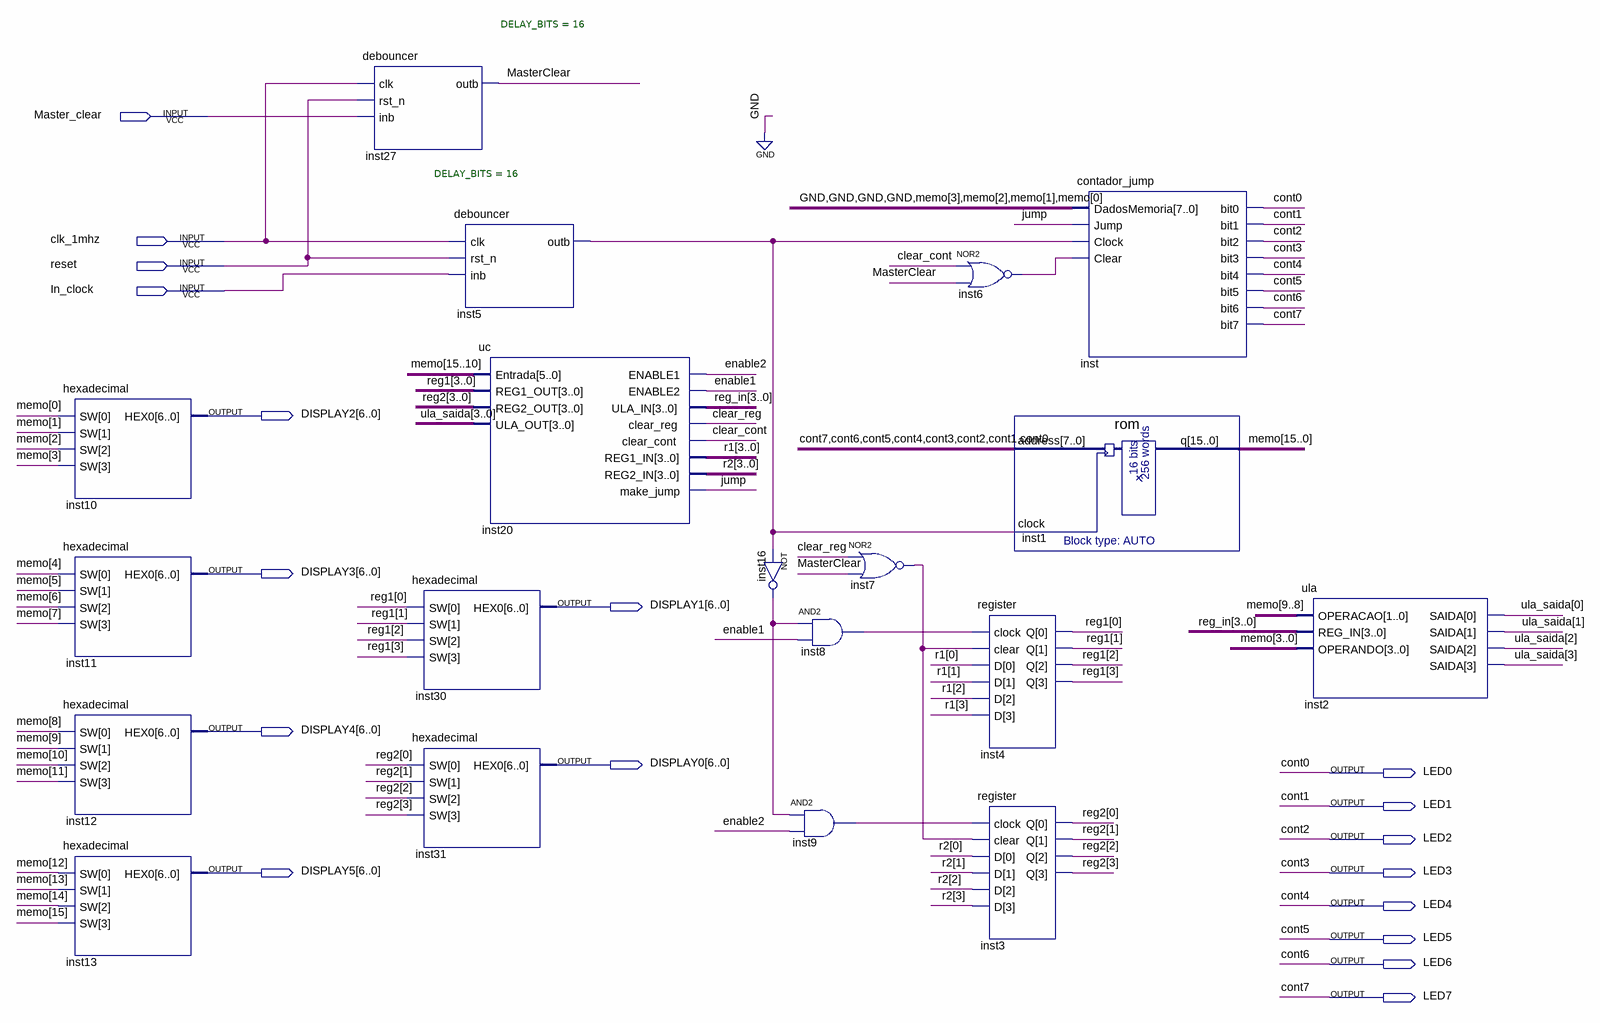
[diagram p0: schematic sheet]
// Quartus schematic CPU.bdf as structural Verilog: 19 symbols, 18 pins
module CPU (
  input  Master_clear,
  input  clk_1mhz,
  input  reset,
  input  In_clock,
  output [6:0] DISPLAY2,
  output [6:0] DISPLAY3,
  output [6:0] DISPLAY1,
  output [6:0] DISPLAY4,
  output [6:0] DISPLAY0,
  output LED0,
  output LED1,
  output LED2,
  output [6:0] DISPLAY5,
  output LED3,
  output LED4,
  output LED5,
  output LED6,
  output LED7
);

  wire clear_cont, clear_reg, enable1, enable2, inst5_outb, inst6_out, inst7_out, inst8_out, inst9_out,
       inst16_out, jump, MasterClear;
  wire [3:0] r1, r2, reg1, reg2, reg_in, ula_saida;
  wire [15:0] memo;

  hexadecimal inst10 (.SW(memo[3:0]), .HEX0(DISPLAY2));
  hexadecimal inst11 (.SW(memo[7:4]), .HEX0(DISPLAY3));
  hexadecimal inst12 (.SW(memo[11:8]), .HEX0(DISPLAY4));
  hexadecimal inst13 (.SW(memo[15:12]), .HEX0(DISPLAY5));
  debouncer #(.DELAY_BITS(16)) inst27 (.clk(clk_1mhz), .rst_n(reset), .inb(Master_clear), .outb(MasterClear));
  hexadecimal inst30 (.SW(reg1), .HEX0(DISPLAY1));
  hexadecimal inst31 (.SW(reg2), .HEX0(DISPLAY0));
  debouncer #(.DELAY_BITS(16)) inst5 (.clk(clk_1mhz), .rst_n(reset), .inb(In_clock), .outb(inst5_outb));
  uc inst20 (
    .Entrada(memo[15:10]), .REG1_OUT(reg1), .REG2_OUT(reg2), .ULA_OUT(ula_saida), .ENABLE1(enable2),
    .ENABLE2(enable1), .ULA_IN(reg_in), .clear_reg(clear_reg), .clear_cont(clear_cont), .REG1_IN(r1),
    .REG2_IN(r2), .make_jump(jump));
  not inst16 (inst16_out, inst5_outb);
  and inst8 (inst8_out, inst16_out, enable1);
  and inst9 (inst9_out, inst16_out, enable2);
  nor inst7 (inst7_out, clear_reg, MasterClear);
  nor inst6 (inst6_out, clear_cont, MasterClear);
  rom inst1 (.address({LED7, LED6, LED5, LED4, LED3, LED2, LED1, LED0}), .clock(inst5_outb), .q(memo));
  register inst4 (.clock(inst8_out), .clear(inst7_out), .D(r1), .Q(reg1));
  register inst3 (.clock(inst9_out), .clear(inst7_out), .D(r2), .Q(reg2));
  contador_jump inst (
    .DadosMemoria({4'b0000, memo[3:0]}), .Jump(jump), .Clock(inst5_outb), .Clear(inst6_out), .bit0(LED0),
    .bit1(LED1), .bit2(LED2), .bit3(LED3), .bit4(LED4), .bit5(LED5), .bit6(LED6), .bit7(LED7));
  ula inst2 (.OPERACAO(memo[9:8]), .REG_IN(reg_in), .OPERANDO(memo[3:0]), .SAIDA(ula_saida));

  // Other names for the same wires on the sheet: cont0 = LED0; cont1 = LED1; cont2 = LED2; cont3 = LED3; cont4 = LED4;
  //   cont5 = LED5; cont6 = LED6; cont7 = LED7
endmodule
